# Altium schematic sheet USB_PD.SchDoc: USB_PD
size A4; Date: Not used; ApprovedBy: Not used; CheckedBy: Not used; Author: Not used; CompanyName: STMicroelectronics; DrawnBy: Not used; Engineer: Not used; Organization: Not used; Address1: Not used; Address2: Not used; Address3: Not used; Address4: Not used; DocumentNumber: Not used; Revision: Not used; SheetNumber: 5; SheetTotal: 22; CurrentTime: Not used; CurrentDate: Not used; Time: Not used; DocumentFullPathAndName: Not used; DocumentName: Not used; ModifiedDate: Not used; ImagePath: Not used; ProjectName: Not used; Application_BuildNumber: Not used
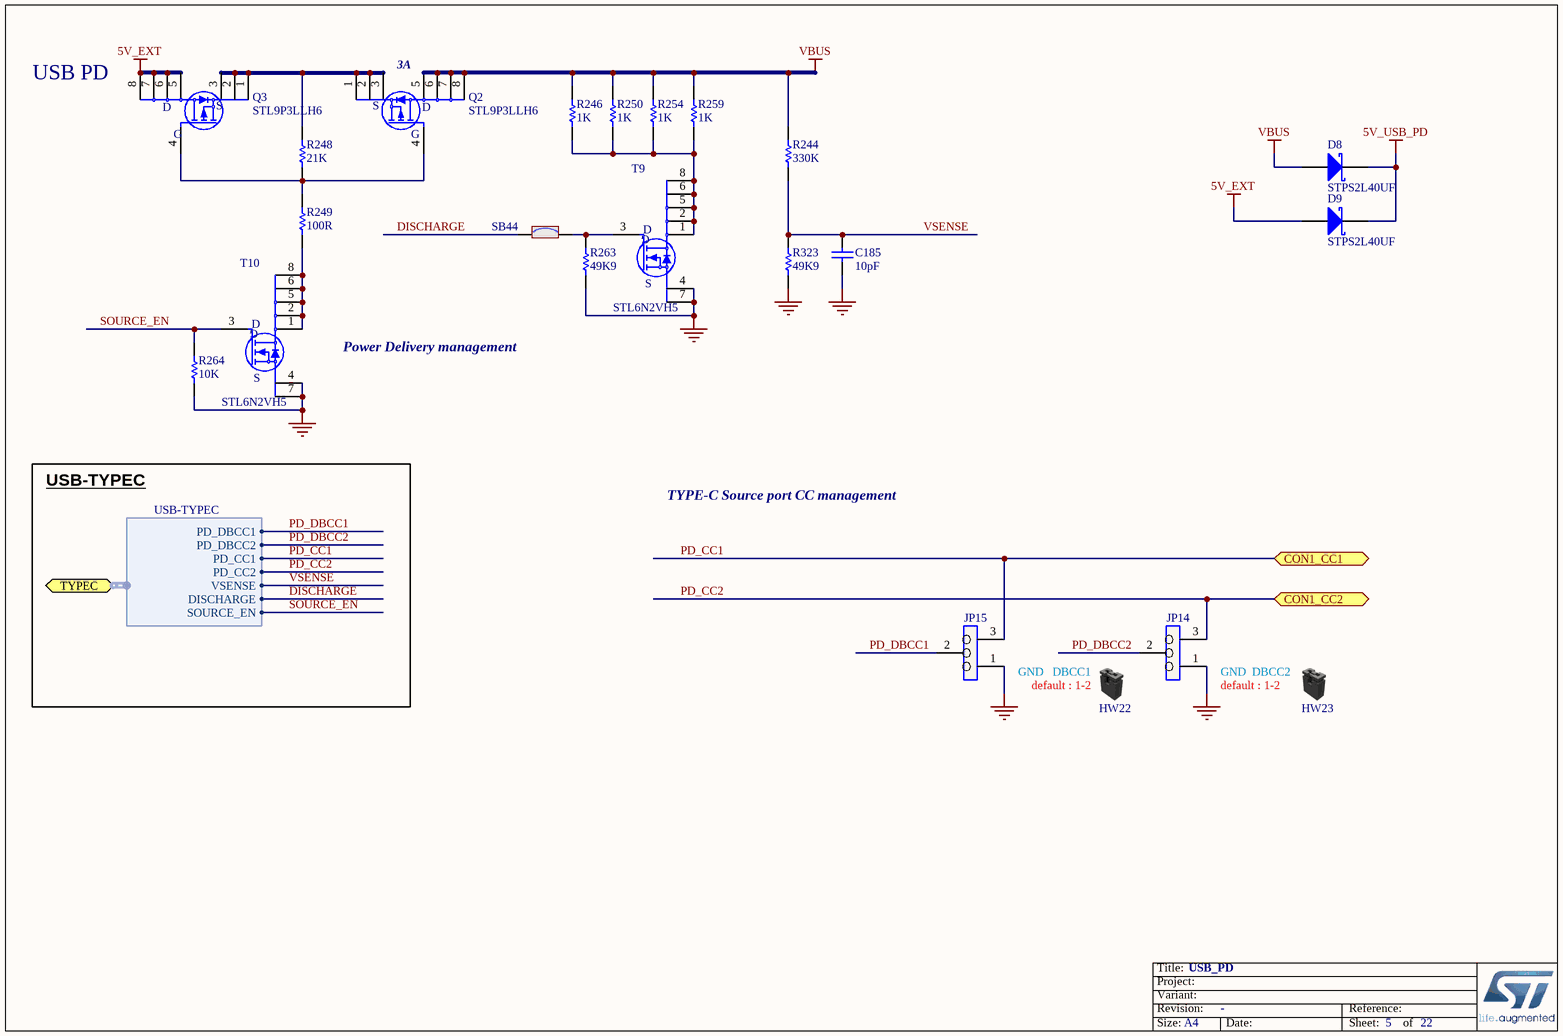
[diagram p0: USB_PD.SchDoc]

## Parts
C185  value 10pF  [C0603]  (hidden comment: Capacitor)
D8  STPS2L40UF  [DIO_SMB-FLAT_1A_2K]
D9  STPS2L40UF  [DIO_SMB-FLAT_1A_2K]
HW22  Shunt Black 2.54mm  (value not drawn)  (mechanical)
HW23  Shunt Black 2.54mm  (value not drawn)  (mechanical)
JP14  Jumper_Header 3x1  [CON_SAMTEC_TSW-103-07-F-S]  (value not drawn)
JP15  Jumper_Header 3x1  [CON_SAMTEC_TSW-103-07-F-S]  (value not drawn)
Q2  STL9P3LLH6  [MOS_POWERFLAT_3P3X3P3_P065]
Q3  STL9P3LLH6  [MOS_POWERFLAT_3P3X3P3_P065]
R244  value 330K  [R0603]  (hidden comment: Resistor)
R246  value 1K  [R0603]  (hidden comment: Resistor)
R248  value 21K  [R0603]  (hidden comment: Resistor)
R249  value 100R  [R0603]  (hidden comment: Resistor)
R250  value 1K  [R0603]  (hidden comment: Resistor)
R254  value 1K  [R0603]  (hidden comment: Resistor)
R259  value 1K  [R0603]  (hidden comment: Resistor)
R263  value 49K9  [R0603]  (hidden comment: Resistor)
R264  value 10K  [R0603]  (hidden comment: Resistor)
R323  value 49K9  [R0603]  (hidden comment: Resistor)
SB44  SB_ON  [SOLDER-BRIDGE_R0603-0R]  (value not drawn)
T9  STL6N2VH5  [MOS_POWERFLAT_2X2_P065]
T10  STL6N2VH5  [MOS_POWERFLAT_2X2_P065]

## Ports
CON1_CC1, CON1_CC2, TYPEC (harness USB-TYPEC)

## Harnesses
USB-TYPEC: PD_DBCC1, PD_DBCC2, PD_CC1, PD_CC2, VSENSE, DISCHARGE, SOURCE_EN

## Nets
5V_EXT: D9.1(A) Q3.5(D) Q3.6(D) Q3.7(D) Q3.8(D)
5V_USB_PD: D8.2(K) D9.2(K)
GND: C185.1 JP14.1 JP15.1 R263.1 R264.1 R323.1 T9.4(S) T9.7(S) T10.4(S) T10.7(S)
VBUS: D8.1(A) Q2.5(D) Q2.6(D) Q2.7(D) Q2.8(D) R244.2 R246.2 R250.2 R254.2 R259.2
DISCHARGE: SB44.1 ; port TYPEC.DISCHARGE
PD_CC1: JP15.3 ; port CON1_CC1, port TYPEC.PD_CC1
PD_CC2: JP14.3 ; port CON1_CC2, port TYPEC.PD_CC2
PD_DBCC1: JP15.2 ; port TYPEC.PD_DBCC1
PD_DBCC2: JP14.2 ; port TYPEC.PD_DBCC2
SOURCE_EN: R264.2 T10.3(G) ; port TYPEC.SOURCE_EN
VSENSE: C185.2 R244.1 R323.2 ; port TYPEC.VSENSE
NetQ2_1: Q2.1(S) Q2.2(S) Q2.3(S) Q3.1(S) Q3.2(S) Q3.3(S) R248.2
NetQ2_4: Q2.4(G) Q3.4(G) R248.1 R249.2
NetR246_1: R246.1 R250.1 R254.1 R259.1 T9.1(D) T9.2(D) T9.5(D) T9.6(D) T9.8(D)
NetR249_1: R249.1 T10.1(D) T10.2(D) T10.5(D) T10.6(D) T10.8(D)
NetR263_2: R263.2 SB44.2 T9.3(G)

## Notes on the sheet
- (near Q3) USB PD
- (near Q2) 3A
- Power Delivery management
- USB-TYPEC
- TYPE-C Source port CC management
- (near HW22) GND   DBCC1
- (near HW22) default : 1-2
- (near HW23) default : 1-2
- (near HW23) GND  DBCC2
- Title:
- Project:
- Size:
- Revision:
- Variant:
- A4
- -
- Date:
- Reference:
- Sheet:
- of

## Library data of the parts
C185 = MCD-00637: Capacitor, MLCC, 10pF, 50V, NPO, 5%, 0603, T=0,8mm; Manufacturer_Part_Number: CC0603JRNPO9BN100; Manufacturer: YAGEO; Provided_By: SUBCO; Initial_Board_Reference: MB1319; Path: ws/MCD_ApplicationBoards/Lists/MCDPARTSdatabase; Item Type: Item; Internal_Part_Number: MCD-00637; Status: Released; Part_Type: Capacitor; Package: C0603; ComponentLink1Description: Datasheet; ComponentLink1URL: http://tunmcdsvn.tun.st.com/Component_Datasheet_Library/Trunk/Capacitors/Yageo_Capacitor_NP0_16V-to-50V
D8 D9 = MCD-01087: Low drop power Schottky rectifier(2A, 40V, 0.34V); Part_Type: Diode; Manufacturer: STMICROELECTRONICS; BMS_Part_Number: 9151009; Provided_By: SUBCO with ST control; Initial_Board_Reference: MB1381; Remark: Anode = pin 1; Path: ws/MCD_ApplicationBoards/Lists/MCDPARTSdatabase; Item Type: Item; Internal_Part_Number: MCD-01087; Value: STPS2L40UF; Status: Footprint available; Manufacturer_Part_Number: STPS2L40UF; Package: SMBflat; ComponentLink1Description: Datasheet; ComponentLink1URL: http://tunmcdsvn.tun.st.com/Component_Datasheet_Library/Trunk/Diodes/STM_Schottky_STPS2L40UF/STM_Schottky_STPS2L40UF.pdf
HW22 HW23 = MCD-00043: SHUNT 2.54mm BLACK; Part_Type: Mechanical; Manufacturer_Part_Number: SNT-100-BK-G; Manufacturer: SAMTEC; Provided_By: SUBCO; Initial_Board_Reference: MB1274; Value: SNT-100-BK-G; Path: ws/MCD_ApplicationBoards/Lists/MCDPARTSdatabase; Item Type: Item; Internal_Part_Number: MCD-00043; Status: Released; ComponentLink1Description: Datasheet; ComponentLink1URL: http://tunmcdsvn.tun.st.com/Component_Datasheet_Library/Trunk/Connectors/Samtec_Shunt_Jumper_SNT100
JP14 JP15 = MCD-00111: Header, 3x1, 2,54mm, VR, TH, Height 5.84mm/2.54mm; Part_Type: Connector; Manufacturer_Part_Number: TSW-103-07-F-S; Manufacturer: SAMTEC; Provided_By: SUBCO; Initial_Board_Reference: MB1262; Path: ws/MCD_ApplicationBoards/Lists/MCDPARTSdatabase; Item Type: Item; Internal_Part_Number: MCD-00111; Value: Header 3x1; Status: Released; ComponentLink1Description: Datasheet; ComponentLink1URL: http://tunmcdsvn.tun.st.com/Component_Datasheet_Library/Trunk/Connectors/Samtec_TSW-HTSW-series
Q2 Q3 = MCD-01126: Power Mosfet, P-channel,VDS -30V,RDS 12mohm typ,ID -9A; Part_Type: IC; Manufacturer: STMICROELECTRONICS; Provided_By: SUBCO with ST control; Initial_Board_Reference: MB1272; Remark: footprint MOS_POWERFLAT_3P3X3P3_P065 pin 5-8 for solder mask and paste mask profile is same as top layer; Path: ws/MCD_ApplicationBoards/Lists/MCDPARTSdatabase; Item Type: Item; Internal_Part_Number: MCD-01126; Value: STL9P3LLH6; Status: Checked; Manufacturer_Part_Number: STL9P3LLH6; Package: PowerFLAT 3.3x3.3; ComponentLink1Description: Datasheet; ComponentLink1URL: http://tunmcdsvn.tun.st.com/Component_Datasheet_Library/Trunk/IC/STM_POWER_MOSFET_P_STL9P3LLH6
R244 = MCD-00458: Resistor,330K,0603,1%,1/10W; Manufacturer_Part_Number: RC0603FR-07330KL; Manufacturer: YAGEO; Provided_By: SUBCO; Initial_Board_Reference: MBxxxx; Path: ws/MCD_ApplicationBoards/Lists/MCDPARTSdatabase; Item Type: Item; Internal_Part_Number: MCD-00458; Status: Released; Part_Type: Resistor; Package: R0603; ComponentLink1Description: Datasheet; ComponentLink1URL: http://tunmcdsvn.tun.st.com/Component_Datasheet_Library/Trunk/Resistors/Yageo_Resistor_RC0603-series
R246 R250 R254 R259 = MCD-00070: Resistor,1K,0603,1%,1/10W; Manufacturer_Part_Number: RC0603FR-071KL; Manufacturer: YAGEO; Provided_By: SUBCO; Initial_Board_Reference: MB1274; Path: ws/MCD_ApplicationBoards/Lists/MCDPARTSdatabase; Item Type: Item; Internal_Part_Number: MCD-00070; Status: Released; Part_Type: Resistor; Package: R0603; ComponentLink1Description: Datasheet; ComponentLink1URL: http://tunmcdsvn.tun.st.com/Component_Datasheet_Library/Trunk/Resistors/Yageo_Resistor_RC0603-series
R248 = MCD-01189: Resistor,21K,0603,1%,1/10W; Manufacturer_Part_Number: RC0603FR-0721KL; Manufacturer: YAGEO; Provided_By: SUBCO; Initial_Board_Reference: MB1397; Path: ws/MCD_ApplicationBoards/Lists/MCDPARTSdatabase; Item Type: Item; Internal_Part_Number: MCD-01189; Status: Released; Part_Type: Resistor; Package: R0603; ComponentLink1Description: Datasheet; ComponentLink1URL: http://tunmcdsvn.tun.st.com/Component_Datasheet_Library/Trunk/Resistors/Yageo_Resistor_RC0603-series
R249 = MCD-00224: Resistor,100R,0603,1%,1/10W; Manufacturer_Part_Number: RC0603FR-07100RL; Manufacturer: YAGEO; Provided_By: SUBCO; Initial_Board_Reference: MB1319; Path: ws/MCD_ApplicationBoards/Lists/MCDPARTSdatabase; Item Type: Item; Internal_Part_Number: MCD-00224; Status: Released; Part_Type: Resistor; Package: R0603; ComponentLink1Description: Datasheet; ComponentLink1URL: http://tunmcdsvn.tun.st.com/Component_Datasheet_Library/Trunk/Resistors/Yageo_Resistor_RC0603-series
R263 R323 = MCD-01171: Resistor,49K9,0603,1%; Manufacturer_Part_Number: RC0603FR-0749K9L; Manufacturer: YAGEO; Provided_By: SUBCO; Initial_Board_Reference: MB1397; Path: ws/MCD_ApplicationBoards/Lists/MCDPARTSdatabase; Item Type: Item; Internal_Part_Number: MCD-01171; Status: Released; Part_Type: Resistor; Package: R0603; ComponentLink1Description: Datasheet; ComponentLink1URL: http://tunmcdsvn.tun.st.com/Component_Datasheet_Library/Trunk/Resistors/Yageo_Resistor_RC0603-series/
R264 = MCD-00220: Resistor,10K,0603,1%,1/10W; Manufacturer_Part_Number: RC0603FR-0710KL; Manufacturer: YAGEO; Provided_By: SUBCO; Initial_Board_Reference: MB1319; Path: ws/MCD_ApplicationBoards/Lists/MCDPARTSdatabase; Item Type: Item; Internal_Part_Number: MCD-00220; Status: Released; Part_Type: Resistor; Package: R0603; ComponentLink1Description: Datasheet; ComponentLink1URL: http://tunmcdsvn.tun.st.com/Component_Datasheet_Library/Trunk/Resistors/Yageo_Resistor_RC0603-series
SB44 = MCD-00071: Solder Bridge ON; Part_Type: Mechanical; Manufacturer_Part_Number: RC0603JR-070RL; Manufacturer: YAGEO; Provided_By: SUBCO; Initial_Board_Reference: MB1274; Path: ws/MCD_ApplicationBoards/Lists/MCDPARTSdatabase; Item Type: Item; Internal_Part_Number: MCD-00071; Status: Released; ComponentLink1Description: Datasheet; Package: SB0603; ComponentLink1URL: http://tunmcdsvn.tun.st.com/Component_Datasheet_Library/Trunk/Resistors/Yageo_Resistor_RC0603-series
T9 T10 = MCD-01028: N-channel 20 V, 0.025 O typ., 6 A STripFET™ V Power MOSFET in a PowerFLAT™ 2x2 package; Part_Type: IC; Manufacturer: STMICROELECTRONICS; BMS_Part_Number: 9153558; Provided_By: SUBCO with ST control; Initial_Board_Reference: MB1378; Remark: Update with official footprint according to layout rules; Path: ws/MCD_ApplicationBoards/Lists/MCDPARTSdatabase; Item Type: Item; Internal_Part_Number: MCD-01028; Value: STL6N2VH5; Status: Checked; Manufacturer_Part_Number: STL6N2VH5; Package: PowerFLAT 2x2; ComponentLink1Description: Datasheet; ComponentLink1URL: http://tunmcdsvn.tun.st.com/Component_Datasheet_Library/Trunk/IC/STM_POWER_MOSFET_N_STL6N2VH5